# Altium schematic sheet TPS65185.SchDoc
size A3; SheetNumber: 1; SheetTotal: 1
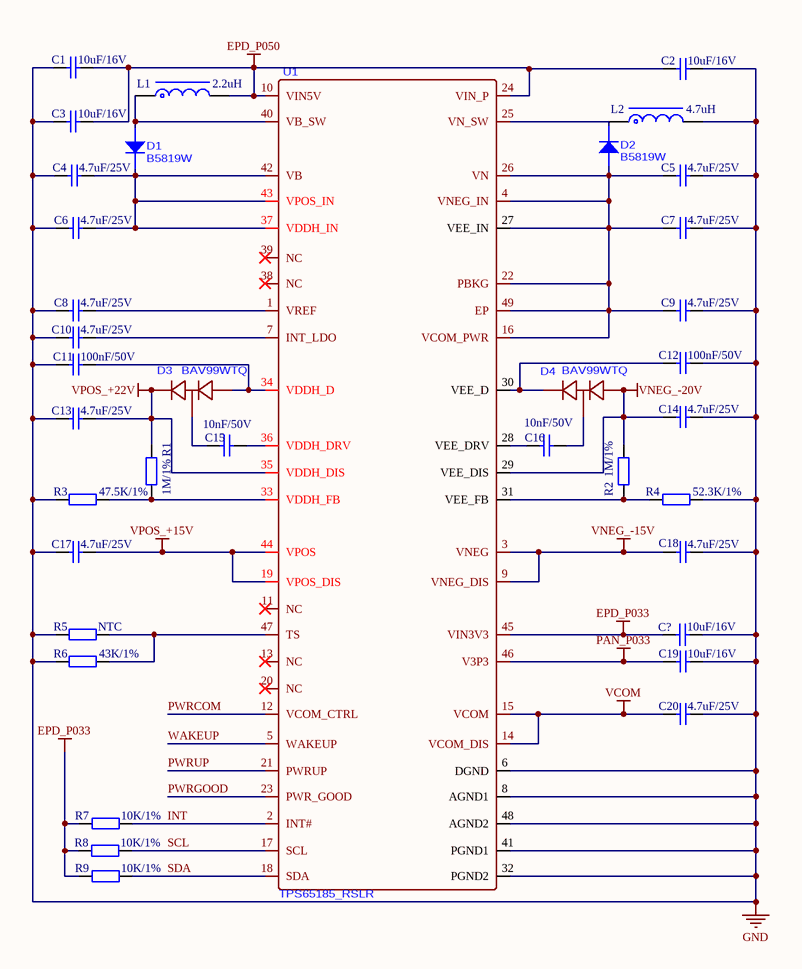
[diagram p0: TPS65185.SchDoc]

## Parts
C1  10uF/16V  [C0603_L]
C2  10uF/16V  [C0603_L]
C3  10uF/16V  [C0603_L]
C4  4.7uF/25V  [C0603_L]
C5  4.7uF/25V  [C0603_L]
C6  4.7uF/25V  [C0603_L]
C7  4.7uF/25V  [C0603_L]
C8  4.7uF/25V  [C0603_L]
C9  4.7uF/25V  [C0603_L]
C10  4.7uF/25V  [C0603_L]
C11  100nF/50V  [C0603_L]
C12  100nF/50V  [C0603_L]
C13  4.7uF/25V  [C0603_L]
C14  4.7uF/25V  [C0603_L]
C15  10nF/50V  [C0603_L]
C16  10nF/50V  [C0603_L]
C17  4.7uF/25V  [C0603_L]
C18  4.7uF/25V  [C0603_L]
C19  10uF/16V  [C0603_L]
C20  4.7uF/25V  [C0603_L]
C?  10uF/16V  [C0603_L]
D1  B5819W  [SOD-123_L2.8-W1.8-LS3.7-RD]
D2  B5819W  [SOD-123_L2.8-W1.8-LS3.7-RD]
D3  BAV99WTQ  [SOT-323-3_L2.0-W1.3-P1.30-LS2.1-BR]
D4  BAV99WTQ  [SOT-323-3_L2.0-W1.3-P1.30-LS2.1-BR]
L1  2.2uH  [NR4010]
L2  4.7uH  [NR4010]
R1  1M/1%  [R0603_L]
R2  1M/1%  [R0603_L]
R3  47.5K/1%  [R0603_L]
R4  52.3K/1%  [R0603_L]
R5  NTC  [R0603_L]
R6  43K/1%  [R0603_L]
R7  10K/1%  [R0603_L]
R8  10K/1%  [R0603_L]
R9  10K/1%  [R0603_L]
U1  TPS65185_RSLR  [TPS65185_RSLR]

## Nets
EPD_P033: C?.1 R7.2 R8.2 R9.2 U1.45(VIN3V3)
EPD_P050: C1.2 C2.1 C3.2 L1.2 U1.10(VIN5V) U1.24(VIN_P)
GND: C1.1 C2.2 C3.1 C4.1 C5.2 C6.1 C7.2 C8.1 C9.2 C10.1 C11.1 C12.2 C13.1 C14.2 C17.1 C18.2 C19.2 C20.2 C?.2 L2.2 R3.2 R4.2 R5.2 R6.2 U1.6(DGND) U1.8(AGND1) U1.32(PGND2) U1.41(PGND1) U1.48(AGND2)
PAN_P033: C19.1 U1.46(V3P3)
VCOM: C20.1 U1.14(VCOM_DIS) U1.15(VCOM)
VNEG_-15V: C18.1 U1.3(VNEG) U1.9(VNEG_DIS)
VNEG_-20V: C14.1 D4.1 R2.1 U1.29(VEE_DIS)
VPOS_+15V: C17.2 U1.19(VPOS_DIS) U1.44(VPOS)
VPOS_+22V: C13.2 D3.2 R1.1 U1.35(VDDH_DIS)
INT: R7.1 U1.2(INT#)
PWRCOM: U1.12(VCOM_CTRL)
PWRGOOD: U1.23(PWR_GOOD)
PWRUP: U1.21(PWRUP)
SCL: R8.1 U1.17(SCL)
SDA: R9.1 U1.18(SDA)
WAKEUP: U1.5(WAKEUP)
NetC4_2: C4.2 C6.2 D1.1(K) U1.37(VDDH_IN) U1.42(VB) U1.43(VPOS_IN)
NetC5_1: C5.1 C7.1 C9.1 D2.2(A) U1.4(VNEG_IN) U1.16(VCOM_PWR) U1.22(PBKG) U1.26(VN) U1.27(VEE_IN) U1.49(EP)
NetC8_2: C8.2 U1.1(VREF)
NetC10_2: C10.2 U1.7(INT_LDO)
NetC11_2: C11.2 D3.1 U1.34(VDDH_D)
NetC12_1: C12.1 D4.2 U1.30(VEE_D)
NetC15_1: C15.1 D3.3
NetC15_2: C15.2 U1.36(VDDH_DRV)
NetC16_1: C16.1 U1.28(VEE_DRV)
NetC16_2: C16.2 D4.3
NetD1_2: D1.2(A) L1.1 U1.40(VB_SW)
NetD2_1: D2.1(K) L2.1 U1.25(VN_SW)
NetR1_2: R1.2 R3.1 U1.33(VDDH_FB)
NetR2_2: R2.2 R4.1 U1.31(VEE_FB)
NetR5_1: R5.1 R6.1 U1.47(TS)

Not connected (* = marked no-connect by the designer): U1 11(NC)* 13(NC)* 20(NC)* 38(NC)* 39(NC)*

## Library data of the parts
C1-C20 C? = C: 贴片电容; 0.0_BOM名称: 无极性贴片电容; 3.交流分享: Q群514746572,开源更新,欢迎一起交流学习PCB设计; 4.作者声明: 旨为整合最全库集,欢迎转载,禁止商用！-冰凌猫; 5.备注说明: 该库已二次整合过网上各热销库,基本最全,无需重复搜购安装; 1.库作者: 冰凌猫; 2.库版本: v2.0 (2021.03.30)
L1 L2 = L-NR: 太诱-NR磁胶电感; 0.0_BOM名称: NR磁胶电感; 3.交流分享: Q群514746572,开源更新,欢迎一起交流学习PCB设计; 4.作者声明: 旨为整合最全库集,欢迎转载,禁止商用！-冰凌猫; 5.备注说明: 该库已二次整合过网上各热销库,基本最全,无需重复搜购安装; 1.库作者: 冰凌猫; 2.库版本: v2.0 (2021.03.30)
R1-R9 = R: 贴片电阻; 3.交流分享: Q群514746572,开源更新,欢迎一起交流学习PCB设计; 4.作者声明: 旨为整合最全库集,欢迎转载,禁止商用！-冰凌猫; 5.备注说明: 该库已二次整合过网上各热销库,基本最全,无需重复搜购安装; 1.库作者: 冰凌猫; 2.库版本: v2.0 (2021.03.30); 0.0_BOM名称: 贴片电阻